# Altium schematic sheet input.SchDoc: 230 VAC switches inputs connectors circuit
size A4; Date: 2023-02-07; Organization: PRZENIOSLO; Address1: Electronics; Address2: &; Address3: Software; DocumentNumber: 2; SheetNumber: 2; SheetTotal: 6
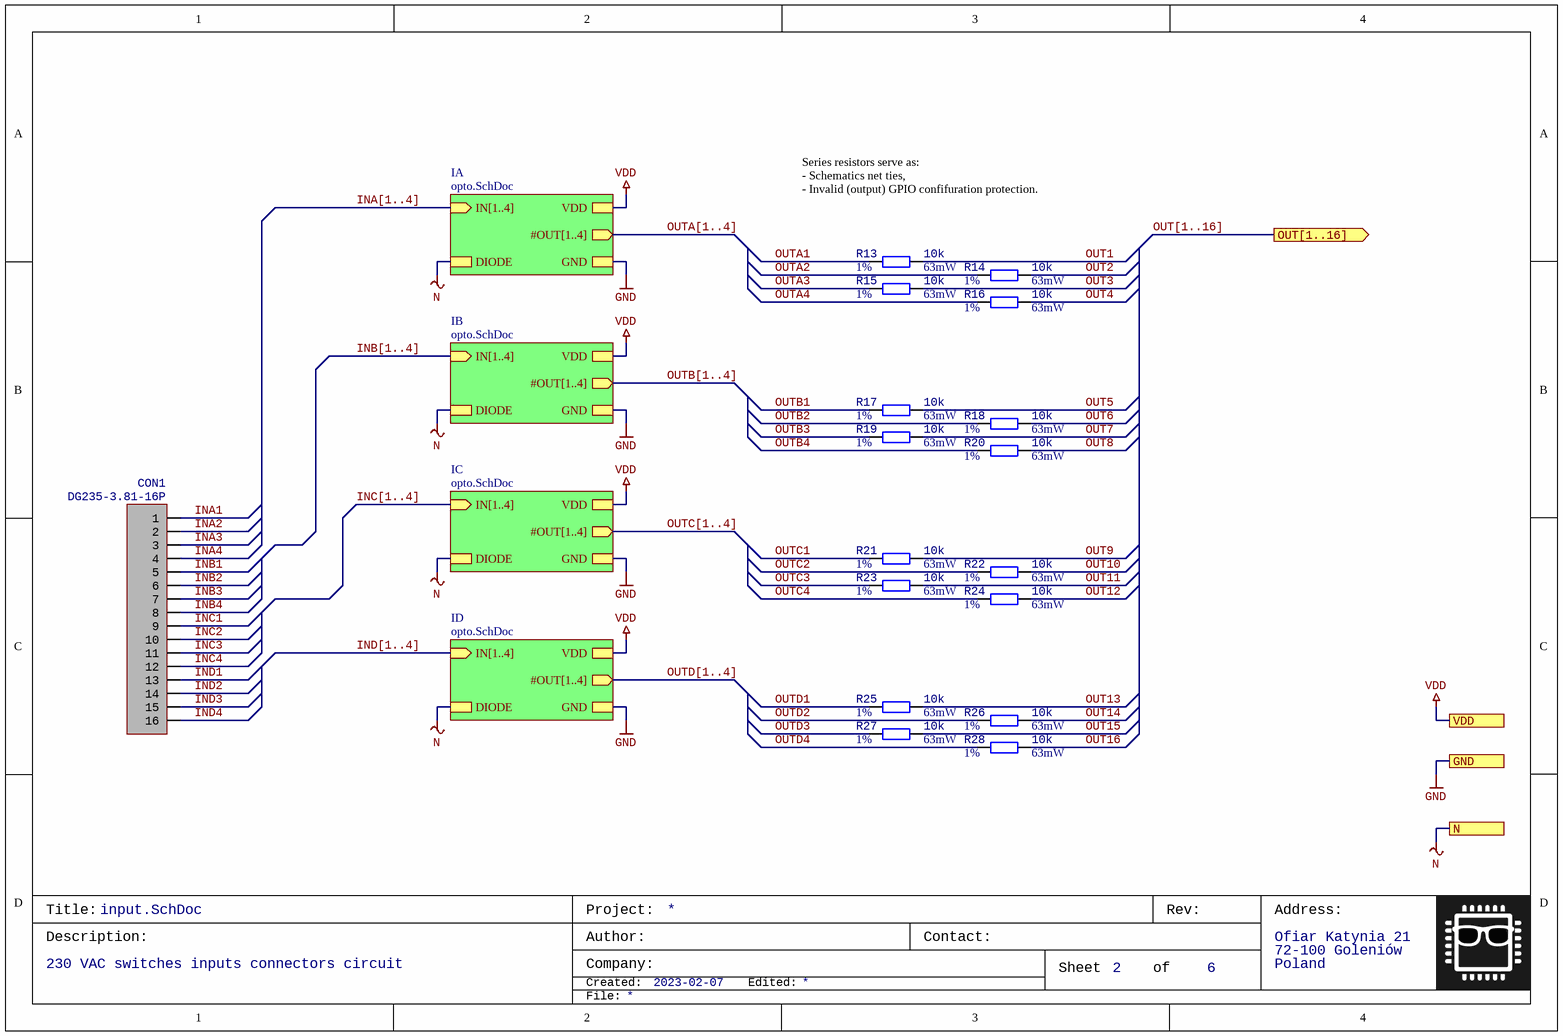
[diagram p0: input.SchDoc]

## Parts
CON1  DG235-3.81-16P  [DG235-3.81-16P]
R13  10k  Power: 63mW  Tolerance: 1%  [RES0603]
R14  10k  Power: 63mW  Tolerance: 1%  [RES0603]
R15  10k  Power: 63mW  Tolerance: 1%  [RES0603]
R16  10k  Power: 63mW  Tolerance: 1%  [RES0603]
R17  10k  Power: 63mW  Tolerance: 1%  [RES0603]
R18  10k  Power: 63mW  Tolerance: 1%  [RES0603]
R19  10k  Power: 63mW  Tolerance: 1%  [RES0603]
R20  10k  Power: 63mW  Tolerance: 1%  [RES0603]
R21  10k  Power: 63mW  Tolerance: 1%  [RES0603]
R22  10k  Power: 63mW  Tolerance: 1%  [RES0603]
R23  10k  Power: 63mW  Tolerance: 1%  [RES0603]
R24  10k  Power: 63mW  Tolerance: 1%  [RES0603]
R25  10k  Power: 63mW  Tolerance: 1%  [RES0603]
R26  10k  Power: 63mW  Tolerance: 1%  [RES0603]
R27  10k  Power: 63mW  Tolerance: 1%  [RES0603]
R28  10k  Power: 63mW  Tolerance: 1%  [RES0603]

## Sub-sheets
IA = opto.SchDoc: #OUT[1..4] (out), IN[1..4] (in), DIODE, VDD, GND
IB = opto.SchDoc: #OUT[1..4] (out), IN[1..4] (in), DIODE, VDD, GND
IC = opto.SchDoc: #OUT[1..4] (out), IN[1..4] (in), DIODE, VDD, GND
ID = opto.SchDoc: #OUT[1..4] (out), IN[1..4] (in), DIODE, VDD, GND

## Ports
GND, N, OUT[1..16] (out), VDD

## Nets
GND: port GND, sheet IA/GND, sheet IB/GND, sheet IC/GND, sheet ID/GND
N: port N, sheet IA/DIODE, sheet IB/DIODE, sheet IC/DIODE, sheet ID/DIODE
VDD: port VDD, sheet IA/VDD, sheet IB/VDD, sheet IC/VDD, sheet ID/VDD
INA1: CON1.1
INA2: CON1.2
INA3: CON1.3
INA4: CON1.4
INB1: CON1.5
INB2: CON1.6
INB3: CON1.7
INB4: CON1.8
INC1: CON1.9
INC2: CON1.10
INC3: CON1.11
INC4: CON1.12
IND1: CON1.13
IND2: CON1.14
IND3: CON1.15
IND4: CON1.16
OUT1: R13.1
OUT2: R14.1
OUT3: R15.1
OUT4: R16.1
OUT5: R17.1
OUT6: R18.1
OUT7: R19.1
OUT8: R20.1
OUT9: R21.1
OUT10: R22.1
OUT11: R23.1
OUT12: R24.1
OUT13: R25.1
OUT14: R26.1
OUT15: R27.1
OUT16: R28.1
OUTA1: R13.2
OUTA2: R14.2
OUTA3: R15.2
OUTA4: R16.2
OUTB1: R17.2
OUTB2: R18.2
OUTB3: R19.2
OUTB4: R20.2
OUTC1: R21.2
OUTC2: R22.2
OUTC3: R23.2
OUTC4: R24.2
OUTD1: R25.2
OUTD2: R26.2
OUTD3: R27.2
OUTD4: R28.2

## Buses and harness runs
bus INA[1..4] = sheet IA/IN[1..4]
bus INB[1..4] = sheet IB/IN[1..4]
bus INC[1..4] = sheet IC/IN[1..4]
bus IND[1..4] = sheet ID/IN[1..4]
bus OUT[1..16] = port OUT[1..16]
bus OUTA[1..4] = sheet IA/#OUT[1..4]
bus OUTB[1..4] = sheet IB/#OUT[1..4]
bus OUTC[1..4] = sheet IC/#OUT[1..4]
bus OUTD[1..4] = sheet ID/#OUT[1..4]

## Notes on the sheet
- Series resistors serve as:
  - Schematics net ties,
  - Invalid (output) GPIO confifuration protection.
- Title:
- Project:
- Rev:
- Address:
- Description:
- Created:
- Author:
- Company:
- Edited:
- Contact:
- Sheet
- of
- Ofiar Katynia 21
- 72-100 Goleniów
- Poland
- File:

## Library data of the parts
CON1 = DG235-3.81-16P: PCB spring terminal blocks,Rated current:10A.Rated voltage （III/2）:250V,pitch:3.81mm,Color:gray,Contact surface :Tin; Manufacturer: DEGSON ELECTRONICS; Nominal Current: 5A; Identifier: DG235-3.81-16P
R13-R28 = Resistor: Generic resistor symbol; Value: 10k; Manufacturer: *; Identifier: *; Datasheet: *